# Altium schematic sheet Smart+Lora+Node.schdoc
size 217 x 239 mm
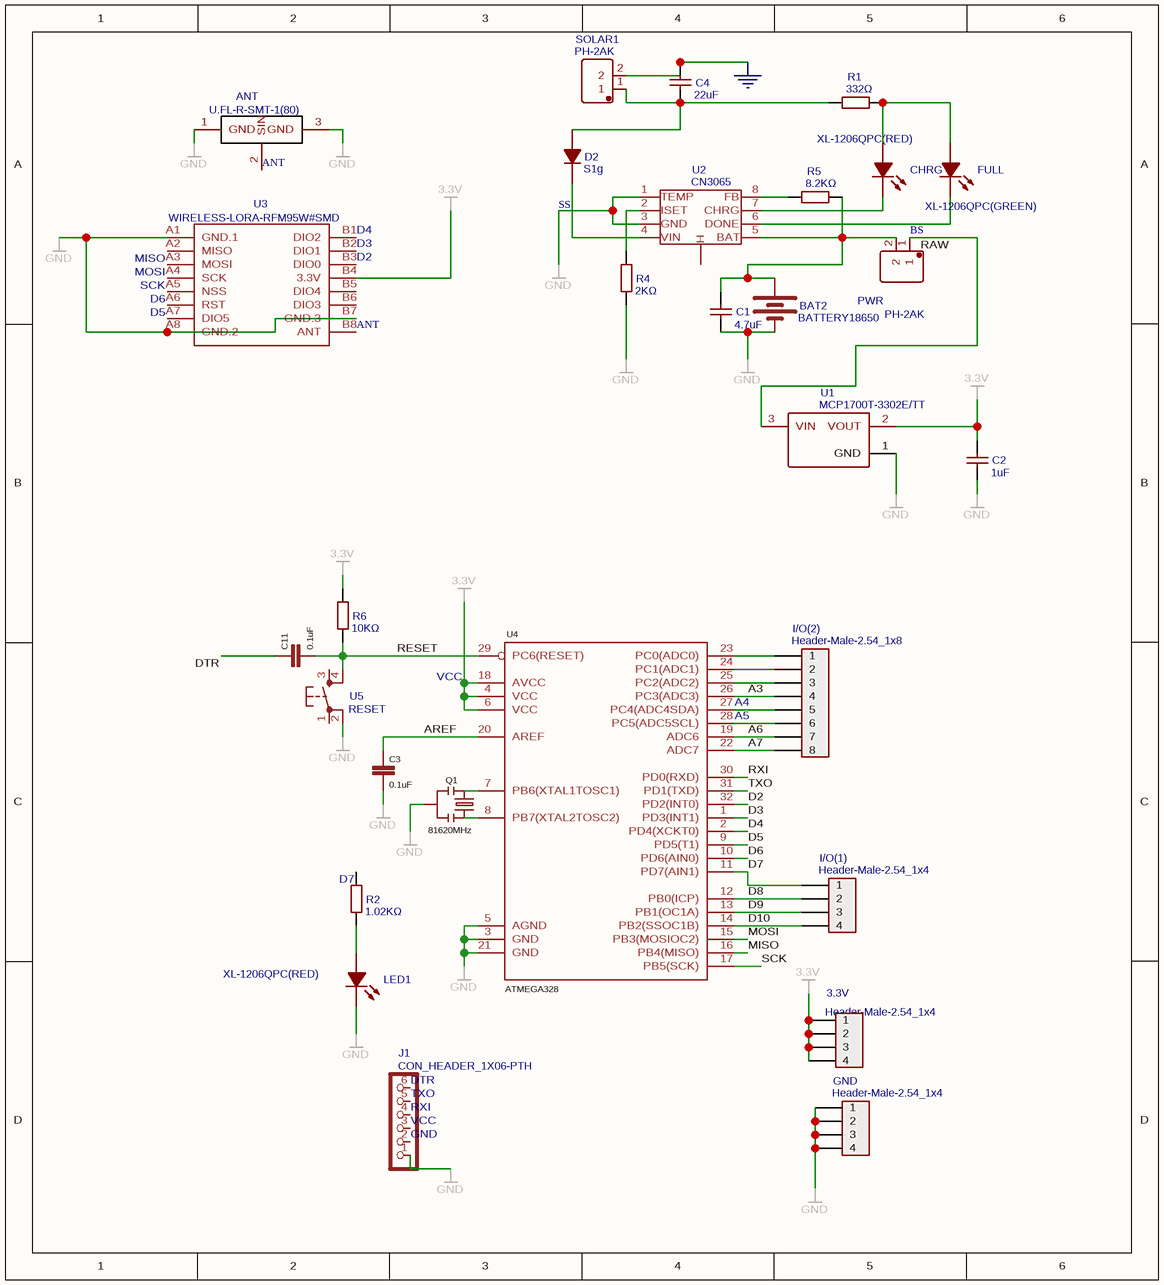
[diagram p0: Smart+Lora+Node.schdoc]

## Parts
3.3V  Header-Male-2.54_1x4  [HDR-4X1/2.54]
ANT  U.FL-R-SMT-1(80)  [U.FL-R-SMT-1(80)]
BAT2  BATTERY18650  [18650 BATTERY HOLDER]
C1  4.7uF  [1206]
C2  1uF  [0805]
C3  0.1uF  [0603-CAP]
C4  22uF  [1206]
C11  0.1uF  [0603-CAP]
CHRG  XL-1206QPC(RED)  [1206]
D2  S1g  [SMA(DO-214AC)]
FULL  XL-1206QPC(GREEN)  [1206]
GND  Header-Male-2.54_1x4  [HDR-4X1/2.54]
I/O(1)  Header-Male-2.54_1x4  [HDR-4X1/2.54]
I/O(2)  Header-Male-2.54_1x8  [HDR-8X1/2.54]
J1  CON_HEADER_1X06-PTH  [M1X6]
LED1  XL-1206QPC(RED)  [1206]
PWR  PH-2AK  [PH-2AK]
Q1  81620MHz  [RESONATOR-SMD]
R1  332Ω  [0805]
R2  1.02KΩ  [0805]
R4  2KΩ  [0805]
R5  8.2KΩ  [1206]
R6  10KΩ  [0805]
SOLAR1  PH-2AK  [PH-2AK]
U1  MCP1700T-3302E/TT  [SOT-23(SOT-23-3)]
U2  CN3065  [DFN8G-0.5-3X3MM]
U3  WIRELESS-LORA-RFM95W#SMD  [WIRELESS-LORA-RFM95WSMD]
U4  ATMEGA328  [TQFP32-08]
U5  RESET  [TACTILE-SWITCH-SMD]

## Nets
GND: ANT.1(GND) ANT.3(GND) BAT2.-GND(-) C1.1 C2.1 C3.1 C4.2 GND.1 GND.2 GND.3 GND.4 J1.1 J1.2 LED1.1(K) Q1.2 R4.1 SOLAR1.2 U1.1(GND) U2.1(TEMP) U2.3(GND) U3.A1(GND.1) U3.A8(GND.2) U3.B7(GND.3) U4.3(GND) U4.5(AGND) U4.21(GND) U5.2
VCC: 3.3V.1 3.3V.2 3.3V.3 3.3V.4 C2.2 J1.3 R6.2 U1.2(VOUT) U3.B4(3.3V) U4.4(VCC) U4.6(VCC) U4.18(AVCC)  [also labelled 3.3V]
A3: I/O(2).4 U4.26(PC3(ADC3))
A4: I/O(2).5 U4.27(PC4(ADC4SDA))
A5: I/O(2).6 U4.28(PC5(ADC5SCL))
A6: I/O(2).7 U4.19(ADC6)
A7: I/O(2).8 U4.22(ADC7)
ANT: ANT.2(SIN) U3.B8(ANT)
AREF: C3.2 U4.20(AREF)
BS: PWR.1 U1.3(VIN)  [also labelled RAW]
D2: U3.B3(DIO0) U4.32(PD2(INT0))
D3: U3.B2(DIO1) U4.1(PD3(INT1))
D4: U3.B1(DIO2) U4.2(PD4(XCKT0))
D5: U3.A6(RST) U4.9(PD5(T1))
D6: U3.A5(NSS) U4.10(PD6(AIN0))
D7: I/O(1).1 R2.2 U4.11(PD7(AIN1))
D8: I/O(1).2 U4.12(PB0(ICP))
D9: I/O(1).3 U4.13(PB1(OC1A))
D10: I/O(1).4 U4.14(PB2(SSOC1B))
DTR: C11.2 J1.6
MISO: U3.A2(MISO) U4.16(PB4(MISO))
MOSI: U3.A3(MOSI) U4.15(PB3(MOSIOC2))
RESET: C11.1 R6.1 U4.29(PC6(RESET)) U5.4
RXI: J1.4 U4.30(PD0(RXD))
SCK: U3.A4(SCK) U4.17(PB5(SCK))
SS: D2.2(K) U2.4(VIN)
TXO: J1.5 U4.31(PD1(TXD))
NetBAT2_+BAT: BAT2.+BAT(+) C1.2 PWR.2 R5.2 U2.5(BAT)
NetC4_1: C4.1 D2.1(A) R1.1 SOLAR1.1
NetCHRG_1: CHRG.1(K) U2.7(CHRG)
NetCHRG_2: CHRG.2(A) FULL.2(A) R1.2
NetFULL_1: FULL.1(K) U2.6(DONE)
NetI/O(2)_1: I/O(2).1 U4.23(PC0(ADC0))
NetI/O(2)_2: I/O(2).2 U4.24(PC1(ADC1))
NetI/O(2)_3: I/O(2).3 U4.25(PC2(ADC2))
NetLED1_2: LED1.2(A) R2.1
NetQ1_1: Q1.1 U4.7(PB6(XTAL1TOSC1))
NetQ1_3: Q1.3 U4.8(PB7(XTAL2TOSC2))
NetR4_2: R4.2 U2.2(ISET)
NetR5_1: R5.1 U2.8(FB)

Not connected (* = marked no-connect by the designer): U2 HEAT(H); U3 A7(DIO5) B5(DIO4) B6(DIO3); U5 1 3

## Library data of the parts
3.3V GND I/O(1) = Header-Male-2.54_1x4: BOM_Manufacturer: ReliaPro; BOM_Manufacturer Part: Headers??Pins 1*4P; BOM_Supplier: LCSC; spicePre: P; BOM_Supplier Part: C59481
ANT = U.FL-R-SMT-1(80): BOM_Manufacturer: HRS; BOM_Supplier: LCSC; BOM_Manufacturer Part: U.FL-R-SMT-1(80); spicePre: J; BOM_Supplier Part: C88374
BAT2 = BATTERY18650: catid: 20; description: Battery Holders; Contributor: SparkFun; BOM_Manufacturer Part: ?; spicePre: B
C1 = 4.7uF: BOM_Manufacturer: FH; BOM_Manufacturer Part: 1206B475K500NT; Voltage: 50V; Tolerance: ±10%; Value: 4.7uF; BOM_Supplier: LCSC; BOM_LCSC Assembly: Yes; spicePre: C; BOM_Supplier Part: C29823
C2 = 1uF: BOM_Manufacturer: FH; BOM_Manufacturer Part: 0805B105K500NT; Voltage: 50V; Tolerance: ±10%; Value: 1uF; BOM_Supplier: LCSC; spicePre: C; BOM_Supplier Part: C29822
C4 = 22uF: BOM_Manufacturer: FH; BOM_Manufacturer Part: 1206X226K100NT; Voltage: 10V; Tolerance: ±10%; Value: 22uF; BOM_Supplier: LCSC; spicePre: C; BOM_Supplier Part: C1859
CHRG LED1 = XL-1206QPC(RED): BOM_Manufacturer: LCSC; BOM_Supplier: LCSC; BOM_Manufacturer Part: XL-1206QPC; spicePre: L; BOM_Supplier Part: C10781
D2 = S1g: BOM_Manufacturer: MDD; BOM_Supplier: LCSC; BOM_Manufacturer Part: S1g; spicePre: D; BOM_Supplier Part: C19153
FULL = XL-1206QPC(GREEN): BOM_Manufacturer: LCSC; BOM_Supplier: LCSC; BOM_Manufacturer Part: XL-1206QPC; spicePre: L; BOM_Supplier Part: C10781
I/O(2) = Header-Male-2.54_1x8: BOM_Manufacturer: ReliaPro; BOM_Manufacturer Part: Header2.54mm 1*8P; BOM_Supplier: LCSC; spicePre: P; BOM_Supplier Part: C49256
J1 = CON_HEADER_1X06-PTH: catid: 20; Contributor: DangerousPrototype; BOM_Manufacturer Part: ?; spicePre: J
R1 = 332Ω: BOM_Manufacturer: UniOhm; BOM_Manufacturer Part: 0805W8F3320T5E; Power: 1/8W; Tolerance: ±1%; Value: 332Ω; BOM_Supplier: LCSC; spicePre: R; BOM_Supplier Part: C17632
R2 = 1.02KΩ: BOM_Manufacturer: UniOhm; BOM_Manufacturer Part: 0805W8F1021T5E; Power: 1/8W; Tolerance: ±1%; Value: 1.02KΩ; BOM_Supplier: LCSC; spicePre: R; BOM_Supplier Part: C17369
R4 = 2KΩ: BOM_Manufacturer: UniOhm; BOM_Manufacturer Part: 0805W8J0202T5E; Power: 1/8W; Tolerance: ±5%; Value: 2KΩ; BOM_Supplier: LCSC; spicePre: R; BOM_Supplier Part: C1359
R5 = 8.2KΩ: BOM_Manufacturer: UniOhm; BOM_Manufacturer Part: 1206W4J0822T5E; Power: 1/4W; Tolerance: ±5%; Value: 8.2KΩ; BOM_Supplier: LCSC; spicePre: R; BOM_Supplier Part: C26048
R6 = 10KΩ: BOM_Manufacturer: UniOhm; BOM_Manufacturer Part: 0805W8J0103T5E; Power: 1/8W; Tolerance: ±5%; Value: 10KΩ; BOM_Supplier: LCSC; spicePre: R; BOM_Supplier Part: C25612
U1 = MCP1700T-3302E/TT: BOM_Manufacturer: MICROCHIP; BOM_Supplier: LCSC; BOM_Manufacturer Part: MCP1700T-3302E/TT; spicePre: U; BOM_Supplier Part: C39051
U2 = CN3065: catid: 20; description: SMD PMIC;Liner;Li-Ion/Pol;Charge;4.2V;1-cell; sourceId: RrlDVd7pH; timeStamp: 1448004693; BOM_Manufacturer Part: CN3065; spicePre: U
U3 = WIRELESS-LORA-RFM95W#SMD: BOM_Manufacturer Part: RFM95W-868S2; catid: 20; description: 868915 MHz LoRa Radio Transceiver Module based on SX1276 chip; spicePre: U; BOM_Supplier: RS-Online; BOM_Supplier Part: 125-1259
U5 = RESET: catid: 20; description: Tactile Switch 4 Pins, SPST NO PTS645SM43SMTR92; sourceId: oSs1Bb9vt; timeStamp: 1472039594; BOM_Manufacturer Part: ?; spicePre: U
PWR SOLAR1 = PH-2AK: spicePre: X; BOM_Supplier: LCSC; BOM_Manufacturer Part: ?; BOM_Supplier Part: C8886